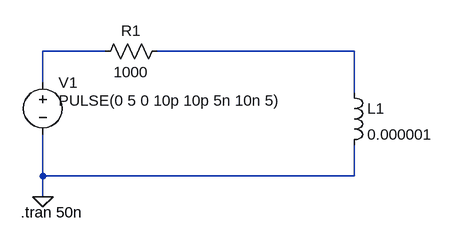
[diagram p0: schematic R = 1K, I= 10^-6.asc]
R = 1K, I= 10^-6.asc, the LTspice schematic file:
Version 4
SHEET 1 880 680
WIRE 160 96 64 96
WIRE 544 96 240 96
WIRE 64 144 64 96
WIRE 544 160 544 96
WIRE 64 288 64 224
WIRE 544 288 544 240
WIRE 544 288 64 288
WIRE 64 320 64 288
FLAG 64 320 0
SYMBOL voltage 64 128 R0
WINDOW 3 24 44 Left 2
WINDOW 123 0 0 Left 0
WINDOW 39 0 0 Left 0
SYMATTR InstName V1
SYMATTR Value PULSE(0 5 0 10p 10p 5n 10n 5)
SYMBOL res 256 80 R90
WINDOW 0 0 56 VBottom 2
WINDOW 3 32 56 VTop 2
SYMATTR InstName R1
SYMATTR Value 1000
SYMBOL ind 528 144 R0
SYMATTR InstName L1
SYMATTR Value 0.000001
TEXT 30 344 Left 2 !.tran 50n

The netlist it stands for:
* R = 1K, I= 10^-6.asc
V1 N001 0 PULSE(0 5 0 10p 10p 5n 10n 5)
R1 N002 N001 1000
L1 N002 0 0.000001
.tran 50n
.backanno
.end